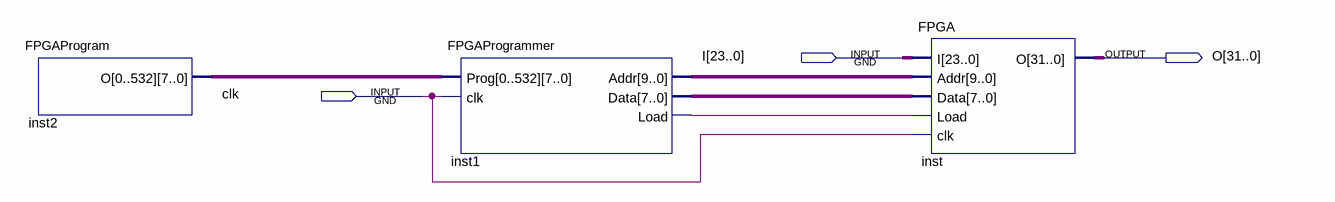
[diagram p0: schematic sheet]
// Quartus schematic FPGAception.bdf as structural Verilog: 3 symbols, 3 pins
module FPGAception (
  input  [23:0] I,
  input  clk,
  output [31:0] O
);

  wire inst1_load;
  wire [7:0] inst1_data;
  wire [9:0] inst1_addr;
  wire [4263:0] inst2_o;

  FPGAProgram inst2 (.O(inst2_o));
  FPGAProgrammer inst1 (.Prog(inst2_o), .clk(clk), .Addr(inst1_addr), .Data(inst1_data), .Load(inst1_load));
  FPGA inst (.I(I), .Addr(inst1_addr), .Data(inst1_data), .Load(inst1_load), .clk(clk), .O(O));
endmodule
